# EAGLE design 8ALPSMultiplexerBoard (EAGLE 9.4.2)
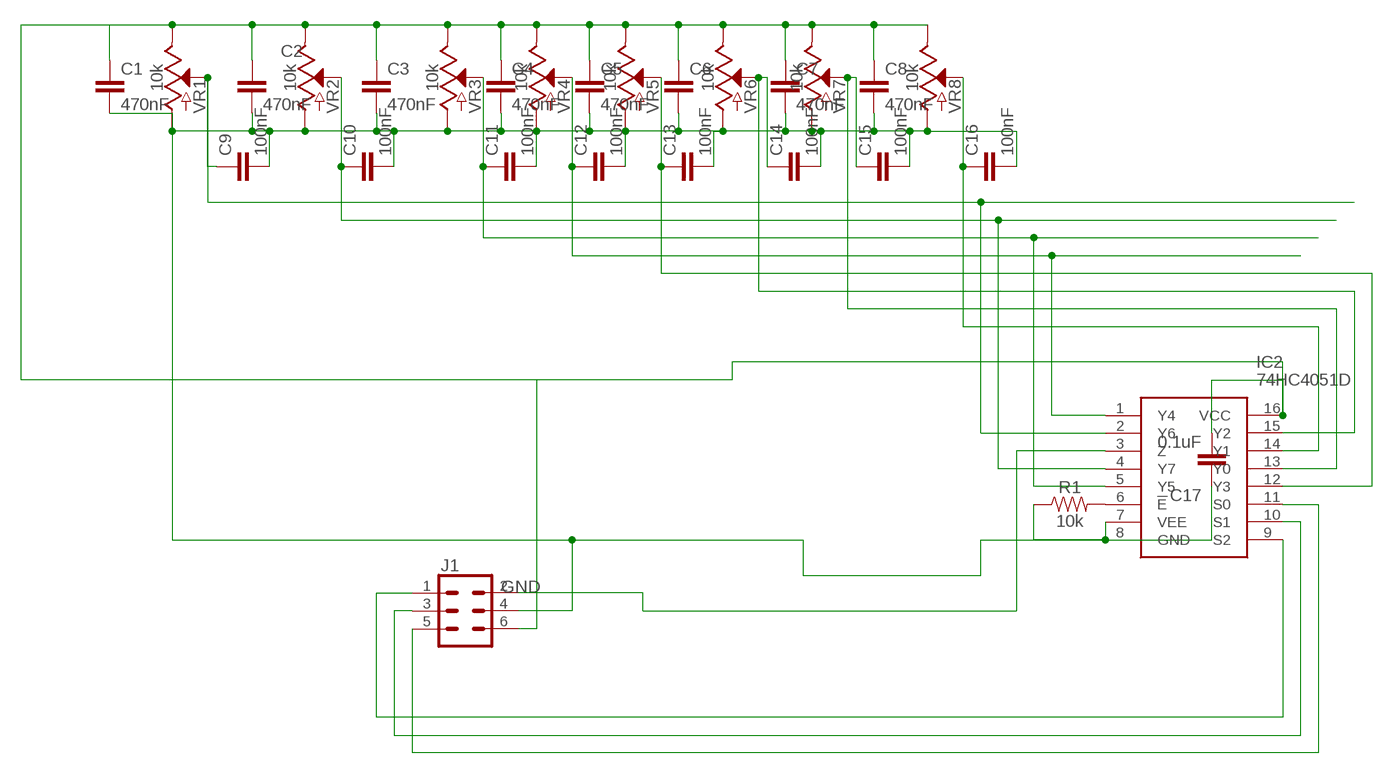
[diagram p0: schematic, sheet 1]

## Parts
C1  470nF  C-EUC0805  [C0805]
C2  470nF  C-EUC0805  [C0805]
C3  470nF  C-EUC0805  [C0805]
C4  470nF  C-EUC0805  [C0805]
C5  470nF  C-EUC0805  [C0805]
C6  C-EUC0805  [C0805]
C7  470nF  C-EUC0805  [C0805]
C8  470nF  C-EUC0805  [C0805]
C9  100nF  C-EUC0805  [C0805]
C10  100nF  C-EUC0805  [C0805]
C11  100nF  C-EUC0805  [C0805]
C12  100nF  C-EUC0805  [C0805]
C13  100nF  C-EUC0805  [C0805]
C14  100nF  C-EUC0805  [C0805]
C15  100nF  C-EUC0805  [C0805]
C16  100nF  C-EUC0805  [C0805]
C17  0.1uF  C-EUC0805  [C0805]
IC2  74HC4051D  [SOIC127P600X175-16N]
J1  CONN_03X2FEMALE  [2X3]
R1  10k  0.75OHM-0805-1/4W-1%  [0805]
VR1  10k  POTENTIOMETER-PTH-9MM-1/20W-20%  [POT-PTH-ALPS]
VR2  10k  POTENTIOMETER-PTH-9MM-1/20W-20%  [POT-PTH-ALPS]
VR3  10k  POTENTIOMETER-PTH-9MM-1/20W-20%  [POT-PTH-ALPS]
VR4  10k  POTENTIOMETER-PTH-9MM-1/20W-20%  [POT-PTH-ALPS]
VR5  10k  POTENTIOMETER-PTH-9MM-1/20W-20%  [POT-PTH-ALPS]
VR6  10k  POTENTIOMETER-PTH-9MM-1/20W-20%  [POT-PTH-ALPS]
VR7  10k  POTENTIOMETER-PTH-9MM-1/20W-20%  [POT-PTH-ALPS]
VR8  10k  POTENTIOMETER-PTH-9MM-1/20W-20%  [POT-PTH-ALPS]

## Nets
GND: C1.2 C2.2 C3.2 C4.2 C5.2 C6.2 C7.2 C8.2 C9.2 C10.2 C11.2 C12.2 C13.2 C14.2 C15.2 C16.2 C17.1 IC2.7(VEE) IC2.8(GND) J1.4 R1.1 VR1.P$3(A) VR2.P$3(A) VR3.P$3(A) VR4.P$3(A) VR5.P$3(A) VR6.P$3(A) VR7.P$3(A) VR8.P$3(A)
N$12: IC2.6(!E) R1.2
S0: IC2.11(S0) J1.5
S1: IC2.10(S1) J1.3
S2: IC2.9(S2) J1.1
VCC: C1.1 C2.1 C3.1 C4.1 C5.1 C6.1 C7.1 C8.1 C17.2 IC2.16(VCC) J1.6 VR1.P$1(E) VR2.P$1(E) VR3.P$1(E) VR4.P$1(E) VR5.P$1(E) VR6.P$1(E) VR7.P$1(E) VR8.P$1(E)
Y0: C9.1 IC2.2(Y6) VR1.P$2(S)
Y1: C10.1 IC2.4(Y7) VR2.P$2(S)
Y2: C11.1 IC2.5(Y5) VR3.P$2(S)
Y3: C12.1 IC2.1(Y4) VR4.P$2(S)
Y4: C13.1 IC2.12(Y3) VR5.P$2(S)
Y5: C14.1 IC2.15(Y2) VR6.P$2(S)
Y6: C15.1 IC2.13(Y0) VR7.P$2(S)
Y7: C16.1 IC2.14(Y1) VR8.P$2(S)
Z: IC2.3(Z) J1.2

## Library data of the parts
C1-C17 = rcl:C-EU: CAPACITOR, European symbol; SPICEPREFIX: C
IC2 = 74HC4051D:74HC4051D: NXP 74HC4051D, Multiplexer/Demultiplexer Single 8:1, 5 V, 16-Pin SOIC Source: Datasheet <https://assets.nexperia.com/documents/data-sheet/74HC_HCT4051.pdf>; DESCRIPTION: NXP 74HC4051D, Multiplexer/Demultiplexer Single 8:1, 5 V, 16-Pin SOIC; HEIGHT: 1.75mm; MANUFACTURER_NAME: Nexperia; MANUFACTURER_PART_NUMBER: 74HC4051D; MOUSER_PART_NUMBER: N/A; MOUSER_PRICE-STOCK: https://www.mouser.com/Search/Refine.aspx?Keyword=N%2FA
J1 = SparkFun-Connectors:CONN_03X2: Multi connection point. Often used as Generic Header-pin footprint for 0.1 inch spaced/style header connections You can populate with any combo of single row headers, but if you'd like an exact match, check these: Header - 2x3 (Male, 0.1") <https://www.sparkfun.com/products/12807> (PRT-12807) Header - 2x3 (Female, 0.1") <https://www.sparkfun.com/products/13010> (PRT-13010) 2x3 Pin Shrouded Header <https://www.sparkfun.com/products/10877> (PRT-10877) On any of the 0.1 inch spaced packages, you can populate with these: Break Away Headers - Straight <https://www.sparkfun.com/products/116> (PRT-00116) Break Away Male Headers - Right Angle <https://www.sparkfun.com/products/553> (PRT-00553) Female Headers <https://www.sparkfun.com/products/115> (PRT-00115) Break Away Headers - Machine Pin <https://www.sparkfun.com/products/117> (PRT-00117) Break Away Female Headers - Swiss Machine Pin <https://www.sparkfun.com/products/743> (PRT-00743) Special note: the shrouded connector mates well with our 3x2 ribbon cables: Ribbon Crimp Connector - 6-pin (2x3, Female) <https://www.sparkfun.com/products/10651> (PRT-10651) Ribbon Cable - 6 wire (15ft) <https://www.sparkfun.com/products/10646> (PRT-10646); PROD_ID: CONN-11566; VALUE: FEMALE 2x3
R1 = SparkFun-Resistors:0.75OHM: 0.75Ω resistor A resistor is a passive two-terminal electrical component that implements electrical resistance as a circuit element. Resistors act to reduce current flow, and, at the same time, act to lower voltage levels within circuits. - Wikipedia; PROD_ID: RES-08474; VALUE: 0.75
VR1-VR8 = SparkFun-Resistors:POTENTIOMETER: Potentiometer (Pot) Three-terminal potentiometers, with an adjustable wiper and two adjustable resistors. A pot can be used to create a configurable voltage divider, or as a variable resistor. Variants ALPS_POT and ALPS_POT_KIT - PTH, breadboard compatible, 9mm square pots Rotary Potentiometer - Linear (10k ohm) <https://www.sparkfun.com/products/9288> (COM-09288) The KIT variant exposes copper on only one side of the PTH pad, so the part can only be assembled on one side of the PCB. Useful for beginner soldering kits.; PROD_ID: RES-09177; SF_SKU: COM-09288

## Board
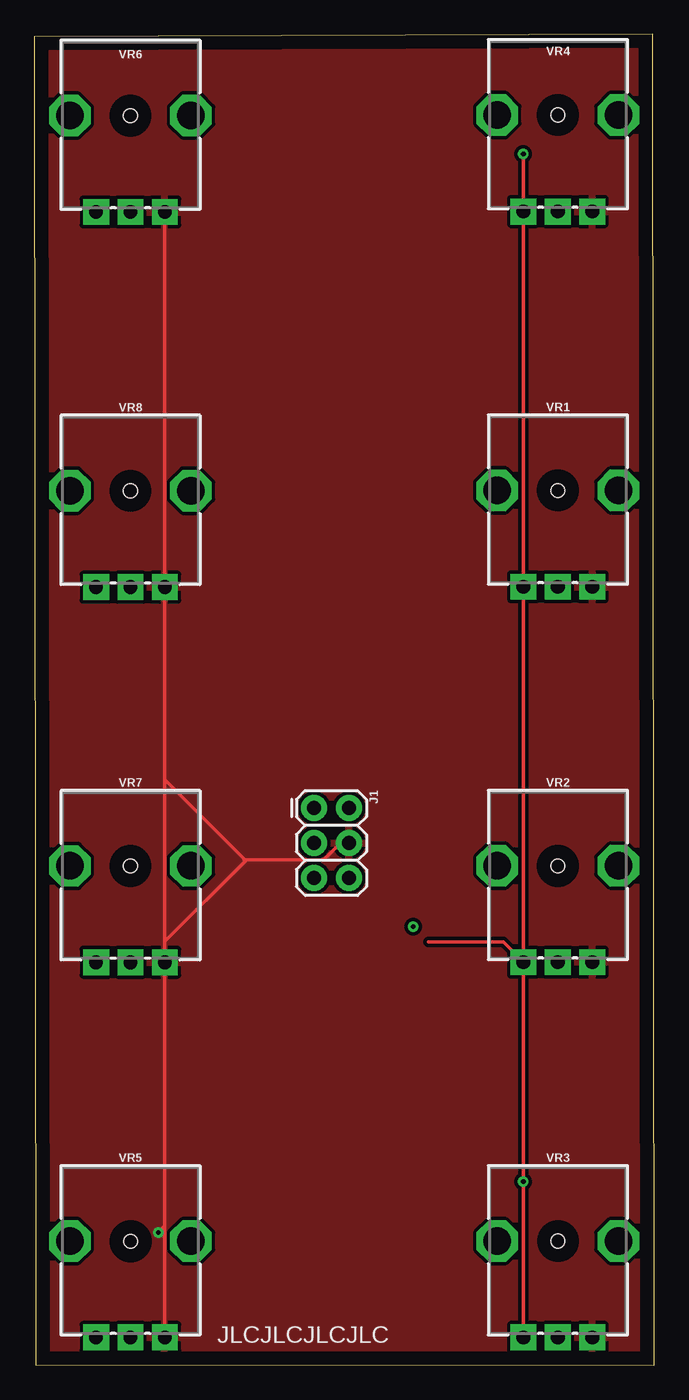
[diagram p1: board, top side]
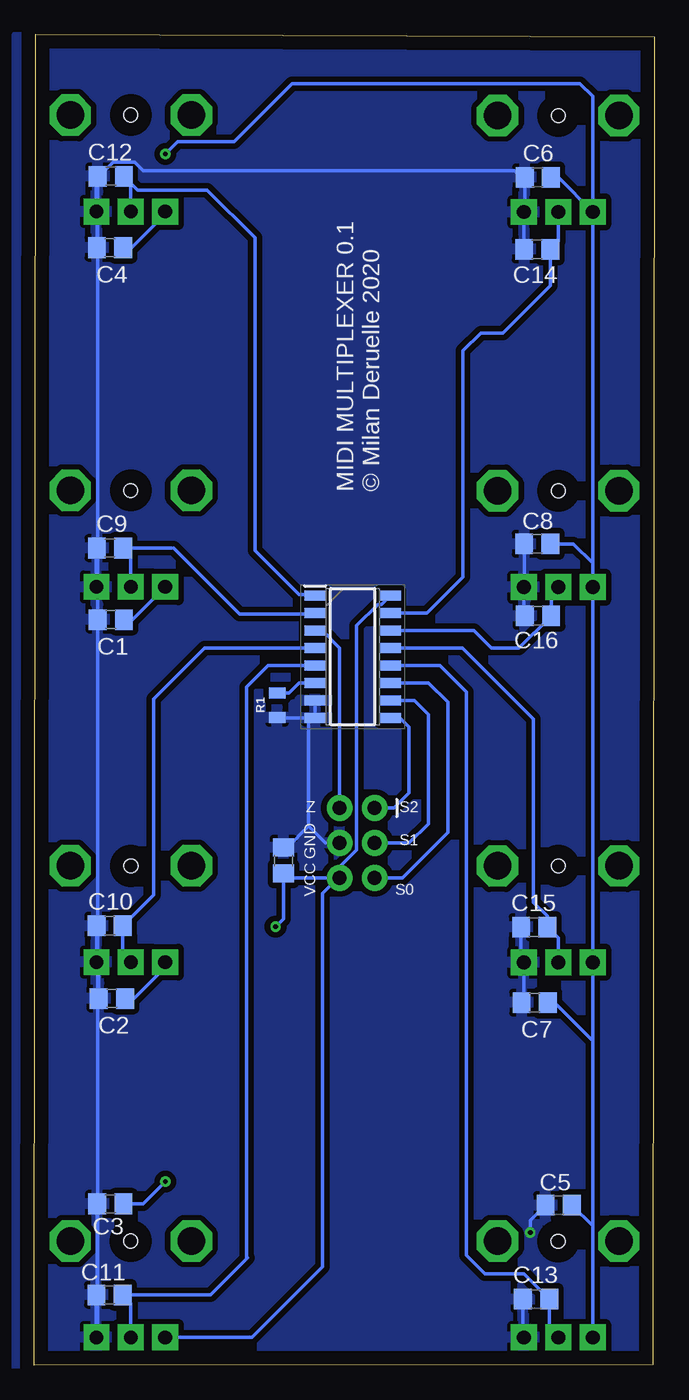
[diagram p2: board, bottom side, seen from below]

Size 45.01 x 96.59 mm. Coordinates in mm from the lower left corner, seen from the top.
Outline: 0.1,0.02 45.01,0 44.91,96.59 0,96.42 0.1,0.02
Copper layers (1*16): Top 0.035mm / dielectric 1.5mm / Bottom 0.035mm
Design rules "default": minimum track width 6mil, minimum drill 0.35mm, track to track 6mil, track to pad 6mil, pad to pad 6mil, via to via 6mil, smd to smd 6mil, copper to edge 40mil, drill to drill 6mil, minimum pad ring 10mil, minimum via ring 8mil, stop-mask expansion 4mil, vias tented up to drill 0mil, thermal gap 10mil
Holes 1 mm at 38.01,90.74 38.01,63.49 38,36.24 38.02,9 6.98,8.99 6.97,36.23 6.97,63.46 6.97,90.7

### Footprints (pad centres in the part's own frame; a part is rotated, then mirrored left to right if it is on the bottom)
C0805 = smd 1.3 x 1.5: 1 -0.95,0; 2 0.95,0
SOIC127P600X175-16N = smd 1.55 x 0.7: 1 -2.725,4.445; 2 -2.725,3.175; 3 -2.725,1.905; 4 -2.725,0.635; 5 -2.725,-0.635; 6 -2.725,-1.905; 7 -2.725,-3.175; 8 -2.725,-4.445; 9 2.725,-4.445; 10 2.725,-3.175; 11 2.725,-1.905; 12 2.725,-0.635; 13 2.725,0.635; 14 2.725,1.905; 15 2.725,3.175; 16 2.725,4.445
2X3 = drill 1.016 pad 1.88: 1 0,0; 2 0,2.54; 3 2.54,0; 4 2.54,2.54; 5 5.08,0; 6 5.08,2.54
0805 = smd 0.8 x 1.2: 1 -0.9,0; 2 0.9,0
POT-PTH-ALPS = drill 1 pad 1.88 square: P$1 7,-2.5; P$2 7,0; P$3 7,2.5 | drill 2 octagon: P$4 0,-4.4; P$5 0,4.4

### Placement (x,y rotation side)
C1  39.46,54.11 180 bottom
C2  39.38,26.61 180 bottom
C3  39.5,11.71 180 bottom
C4  39.52,81.11 180 bottom
C5  6.94,11.61 180 bottom
C6  8.46,86.21 180 bottom
C7  8.68,26.31 180 bottom
C8  8.5,59.61 180 bottom
C9  39.52,59.31 180 bottom
C10  39.54,31.89 180 bottom
C11  39.56,5.09 180 bottom
C12  39.46,86.29 180 bottom
C13  8.58,4.79 180 bottom
C14  8.5,80.99 180 bottom
C15  8.72,31.79 180 bottom
C16  8.44,54.39 180 bottom
C17  26.92,36.63 270 bottom
IC2  21.9,51.42 0 bottom
J1  20.3,40.43 270 top
R1  27.38,47.89 90 bottom
VR1  38.01,63.49 270 top
VR2  38.01,36.25 270 top
VR3  38.01,9 270 top
VR4  38.01,90.74 270 top
VR5  6.97,9 270 top
VR6  6.97,90.7 270 top
VR7  6.97,36.24 270 top
VR8  6.97,63.47 270 top

### Tracks (layer width: path | path; a pad name or v marks a point on that pad's centre or on a via)
GND  (via drill 0.35)
  Top 0.254: J1.4 22.22,37.89 21.01,36.67 15.4,36.67 | 15.4,36.67 15.3,36.67 | 15.3,36.67 15.22,36.67 | VR6.P$3 VR8.P$3 9.47,42.5 | 9.47,42.5 9.47,30.74 | 9.47,30.74 VR7.P$3 9.47,10.09 | 9.47,10.09 VR5.P$3 | 9.47,10.09 v9,9.62 | 15.4,36.67 9.47,30.74 | 15.3,36.67 9.47,42.5
  Bottom 0.254: C12.2 40.41,83.72 | 40.41,83.72 C1.2 | C1.2 40.41,26.53 | 40.41,26.53 40.41,2.1 | 40.41,2.1 VR3.P$3 | 40.41,26.53 C2.2 40.33,29.07 VR2.P$3 40.49,29.27 C10.2 | C1.2 40.41,56.39 VR1.P$3 40.51,59.27 C9.2 | C4.2 40.47,83.66 40.41,83.72 | C12.2 40.51,86.19 VR4.P$3 | 9.47,4.73 C13.2 9.53,2.06 VR5.P$3 | C12.2 40.3,86.29 39.28,87.32 37.74,87.32 37.12,86.7 10.15,86.7 9.47,86.02 9.47,86.15 C6.2 9.41,83.72 9.45,83.68 VR6.P$3 9.47,81.01 C14.2 | C3.2 40.45,5.15 C11.2 40.51,2.2 40.41,2.1 | IC2.7 IC2.8 | IC2.8 24.64,46.99 24.8,46.99 25.1,46.69 25.1,39.12 | J1.4 23.87,37.89 25.1,39.12 | 25.1,39.12 26.64,37.58 C17.1 | IC2.8 27.37,46.98 R1.1 | 9.67,26.35 C7.2 9.47,26.47 VR7.P$3 9.67,29.44 C15.2 | 9.47,59.59 C8.2 9.45,56.49 VR8.P$3 9.47,54.47 C16.2 | C5.2 9,10.5 v9,9.62
  pour Top (isolate 0.254): -6,101.02 49.7,101.02 49.7,-1.18 -7.2,-1.18 -7.2,101.02
  pour Bottom (isolate 0.406): 0.04,96.43 46.3,96.43 46.3,-0.07 0.04,-0.07
N$12
  Bottom 0.254: R1.2 26.53,48.79 25.8,49.52 IC2.6
S0
  Bottom 0.254: IC2.11 16.4,49.52 15,48.12 15,38.65 18.3,35.35 J1.5
S1
  Bottom 0.254: IC2.10 17.43,48.25 16.4,47.22 16.4,39.29 17.8,37.89 J1.3
S2
  Bottom 0.254: IC2.9 18.46,46.98 17.8,46.32 17.8,41.53 18.9,40.43 J1.1
VCC  (via drill 0.35)
  Top 0.254: VR2.P$1 VR3.P$1 v35.51,13.31 v35.5,13.32 | VR2.P$1 VR1.P$1 VR4.P$1 | VR4.P$1 | VR2.P$1 34.04,30.72 28.6,30.72 | VR4.P$1 35.51,87.64 35.51,87.81 v35.51,87.91 v35.5,87.92
  Bottom 0.254: C6.1 6.98,86.21 VR6.P$1 | VR6.P$1 4.47,58.22 | 4.47,58.22 VR8.P$1 VR7.P$1 4.47,23.52 | C8.1 5.86,59.61 4.47,58.22 | 4.47,10.09 VR5.P$1 | VR4.P$1 35.51,83.54 37.94,81.11 C4.1 | VR1.P$1 37.89,54.11 C1.1 | C2.1 37.78,26.61 35.51,28.88 VR2.P$1 | VR6.P$1 4.47,92.09 5.41,93.03 26.29,93.03 30.5,88.82 34.6,88.82 v35.5,87.92 | VR3.P$1 29.22,2 24.1,7.12 24.1,34.25 23,35.35 | C5.1 4.47,10.09 | C7.1 7.26,26.31 4.47,23.52 | C3.1 37.11,11.71 v35.5,13.32 | 23,35.35 J1.6 22.84,36.17 21.62,37.39 21.62,53.67 20.07,55.22 19.82,55.22 IC2.16 | 23,35.35 26.59,35.35 C17.2 26.92,32.4 v27.5,31.82 | 4.47,23.52 4.47,10.09
Y0
  Bottom 0.152: 35.05,59.31 34.89,59.31
  Bottom 0.254: 34.89,59.31 30.1,54.52 24.7,54.52 IC2.2 | 35.05,59.31 C9.1 38.01,58.75 VR1.P$2
Y1
  Bottom 0.254: VR2.P$2 38.59,29.83 C10.1 36.37,34.11 36.37,48.35 32.66,52.05 IC2.4
Y2
  Bottom 0.254: VR3.P$2 38.01,4.49 C11.1 32.23,5.09 29.55,7.77 29.6,7.82 29.6,37.82 29.6,49.22 28.04,50.79 IC2.5
Y3
  Bottom 0.254: VR4.P$2 38.01,85.79 C12.1 37.51,85.29 32.47,85.29 29,81.82 29,59.12 25.8,55.92 24.68,55.92 IC2.1
Y4
  Bottom 0.254: VR5.P$2 7.63,2.66 C13.1 9.46,6.62 12.3,6.62 13.65,7.97 13.65,48.87 15.56,50.79 IC2.12
Y5
  Bottom 0.254: VR6.P$2 6.97,81.57 C14.1 7.55,78.37 11,74.92 12.6,74.92 13.9,73.62 13.9,57.22 16.53,54.6 IC2.15
Y6
  Bottom 0.254: VR7.P$2 6.97,30.99 C15.1 7.77,32.59 8.77,33.59 8.77,46.89 13.94,52.05 IC2.13
Y7
  Bottom 0.254: VR8.P$2 7.49,55.95 C16.1 9.83,52.05 11.83,52.05 13.11,53.33 IC2.14
Z
  Bottom 0.254: J1.2 22.84,52.06 24.11,53.33 IC2.3

### Text on the board
tNames: JLCJLCJLCJLC
bNames: MIDI MULTIPLEXER 0.1 / © Milan Deruelle 2020 | S2 | Z | S1 | GND | S0 | VCC